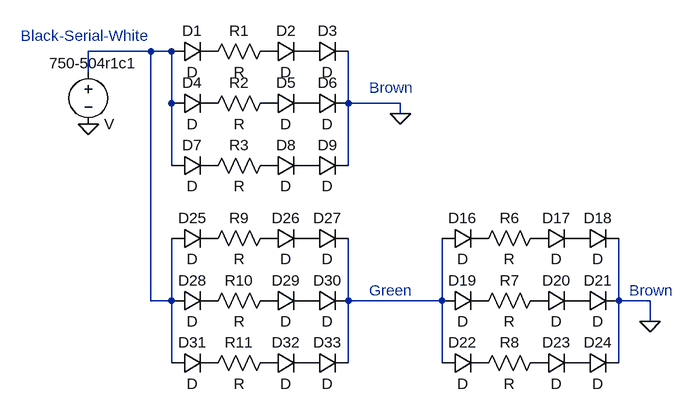
[diagram p0: schematic LTSPICE-LEDCircuit.asc]
LTSPICE-LEDCircuit.asc, the LTspice schematic file:
Version 4
SHEET 1 880 680
WIRE -16 80 -112 80
WIRE 16 80 -16 80
WIRE -112 112 -112 80
WIRE 16 160 16 80
WIRE 288 160 288 80
WIRE 368 160 288 160
WIRE 368 176 368 160
WIRE 16 256 16 160
WIRE 288 256 288 160
WIRE -16 464 -16 80
WIRE 16 464 16 368
WIRE 16 464 -16 464
WIRE 288 464 288 368
WIRE 432 464 432 368
WIRE 432 464 288 464
WIRE 704 464 704 368
WIRE 752 464 704 464
WIRE 752 496 752 464
WIRE 16 560 16 464
WIRE 288 560 288 464
WIRE 432 560 432 464
WIRE 704 560 704 464
FLAG 368 176 0
FLAG 752 496 0
FLAG -112 192 0
SYMBOL diode 16 96 R270
WINDOW 0 32 32 VTop 2
WINDOW 3 0 32 VBottom 2
SYMATTR InstName D1
SYMBOL res 64 96 R270
WINDOW 0 32 56 VTop 2
WINDOW 3 0 56 VBottom 2
SYMATTR InstName R1
SYMBOL diode 160 96 R270
WINDOW 0 32 32 VTop 2
WINDOW 3 0 32 VBottom 2
SYMATTR InstName D2
SYMBOL diode 224 96 R270
WINDOW 0 32 32 VTop 2
WINDOW 3 0 32 VBottom 2
SYMATTR InstName D3
SYMBOL diode 16 176 R270
WINDOW 0 32 32 VTop 2
WINDOW 3 0 32 VBottom 2
SYMATTR InstName D4
SYMBOL diode 160 176 R270
WINDOW 0 32 32 VTop 2
WINDOW 3 0 32 VBottom 2
SYMATTR InstName D5
SYMBOL diode 224 176 R270
WINDOW 0 32 32 VTop 2
WINDOW 3 0 32 VBottom 2
SYMATTR InstName D6
SYMBOL res 64 176 R270
WINDOW 0 32 56 VTop 2
WINDOW 3 0 56 VBottom 2
SYMATTR InstName R2
SYMBOL res 64 272 R270
WINDOW 0 32 56 VTop 2
WINDOW 3 0 56 VBottom 2
SYMATTR InstName R3
SYMBOL diode 160 272 R270
WINDOW 0 32 32 VTop 2
WINDOW 3 0 32 VBottom 2
SYMATTR InstName D8
SYMBOL diode 224 272 R270
WINDOW 0 32 32 VTop 2
WINDOW 3 0 32 VBottom 2
SYMATTR InstName D9
SYMBOL diode 16 272 R270
WINDOW 0 32 32 VTop 2
WINDOW 3 0 32 VBottom 2
SYMATTR InstName D7
SYMBOL diode 16 384 R270
WINDOW 0 32 32 VTop 2
WINDOW 3 0 32 VBottom 2
SYMATTR InstName D25
SYMBOL diode 16 480 R270
WINDOW 0 32 32 VTop 2
WINDOW 3 0 32 VBottom 2
SYMATTR InstName D28
SYMBOL diode 16 576 R270
WINDOW 0 32 32 VTop 2
WINDOW 3 0 32 VBottom 2
SYMATTR InstName D31
SYMBOL diode 160 384 R270
WINDOW 0 32 32 VTop 2
WINDOW 3 0 32 VBottom 2
SYMATTR InstName D26
SYMBOL diode 160 480 R270
WINDOW 0 32 32 VTop 2
WINDOW 3 0 32 VBottom 2
SYMATTR InstName D29
SYMBOL diode 160 576 R270
WINDOW 0 32 32 VTop 2
WINDOW 3 0 32 VBottom 2
SYMATTR InstName D32
SYMBOL diode 224 384 R270
WINDOW 0 32 32 VTop 2
WINDOW 3 0 32 VBottom 2
SYMATTR InstName D27
SYMBOL diode 224 480 R270
WINDOW 0 32 32 VTop 2
WINDOW 3 0 32 VBottom 2
SYMATTR InstName D30
SYMBOL diode 224 576 R270
WINDOW 0 32 32 VTop 2
WINDOW 3 0 32 VBottom 2
SYMATTR InstName D33
SYMBOL res 64 480 R270
WINDOW 0 32 56 VTop 2
WINDOW 3 0 56 VBottom 2
SYMATTR InstName R10
SYMBOL res 64 576 R270
WINDOW 0 32 56 VTop 2
WINDOW 3 0 56 VBottom 2
SYMATTR InstName R11
SYMBOL res 64 384 R270
WINDOW 0 32 56 VTop 2
WINDOW 3 0 56 VBottom 2
SYMATTR InstName R9
SYMBOL diode 432 384 R270
WINDOW 0 32 32 VTop 2
WINDOW 3 0 32 VBottom 2
SYMATTR InstName D16
SYMBOL diode 432 576 R270
WINDOW 0 32 32 VTop 2
WINDOW 3 0 32 VBottom 2
SYMATTR InstName D22
SYMBOL diode 432 480 R270
WINDOW 0 32 32 VTop 2
WINDOW 3 0 32 VBottom 2
SYMATTR InstName D19
SYMBOL res 480 384 R270
WINDOW 0 32 56 VTop 2
WINDOW 3 0 56 VBottom 2
SYMATTR InstName R6
SYMBOL res 480 480 R270
WINDOW 0 32 56 VTop 2
WINDOW 3 0 56 VBottom 2
SYMATTR InstName R7
SYMBOL res 480 576 R270
WINDOW 0 32 56 VTop 2
WINDOW 3 0 56 VBottom 2
SYMATTR InstName R8
SYMBOL diode 576 384 R270
WINDOW 0 32 32 VTop 2
WINDOW 3 0 32 VBottom 2
SYMATTR InstName D17
SYMBOL diode 640 384 R270
WINDOW 0 32 32 VTop 2
WINDOW 3 0 32 VBottom 2
SYMATTR InstName D18
SYMBOL diode 576 480 R270
WINDOW 0 32 32 VTop 2
WINDOW 3 0 32 VBottom 2
SYMATTR InstName D20
SYMBOL diode 640 480 R270
WINDOW 0 32 32 VTop 2
WINDOW 3 0 32 VBottom 2
SYMATTR InstName D21
SYMBOL diode 576 576 R270
WINDOW 0 32 32 VTop 2
WINDOW 3 0 32 VBottom 2
SYMATTR InstName D23
SYMBOL diode 640 576 R270
WINDOW 0 32 32 VTop 2
WINDOW 3 0 32 VBottom 2
SYMATTR InstName D24
SYMBOL voltage -112 96 R0
WINDOW 0 -60 2 Left 2
SYMATTR InstName 750-504r1c1
TEXT 320 448 Left 2 ;Green
TEXT -216 56 Left 2 ;Black-Serial-White
TEXT 320 136 Left 2 ;Brown
TEXT 720 448 Left 2 ;Brown

The netlist it stands for:
* LTSPICE-LEDCircuit.asc
D1 N001 P001 D
R1 P001 P002 R
D2 P002 P003 D
D3 P003 0 D
D4 N001 P004 D
D5 P005 P006 D
D6 P006 0 D
R2 P004 P005 R
R3 P007 P008 R
D8 P008 P009 D
D9 P009 0 D
D7 N001 P007 D
D25 N001 P010 D
D28 N001 P011 D
D31 N001 P012 D
D26 P013 P014 D
D29 P015 P016 D
D32 P017 P018 D
D27 P014 N002 D
D30 P016 N002 D
D33 P018 N002 D
R10 P011 P015 R
R11 P012 P017 R
R9 P010 P013 R
D16 N002 P019 D
D22 N002 P020 D
D19 N002 P021 D
R6 P019 P022 R
R7 P021 P023 R
R8 P020 P024 R
D17 P022 P025 D
D18 P025 0 D
D20 P023 P026 D
D21 P026 0 D
D23 P024 P027 D
D24 P027 0 D
V§750-504r1c1 N001 0 V
.model D D
.lib standard.dio
* Green
* Black-Serial-White
* Brown
* Brown
.backanno
.end